# EAGLE design ESP32_GPS_Motion_Shield (EAGLE 7.7.0)
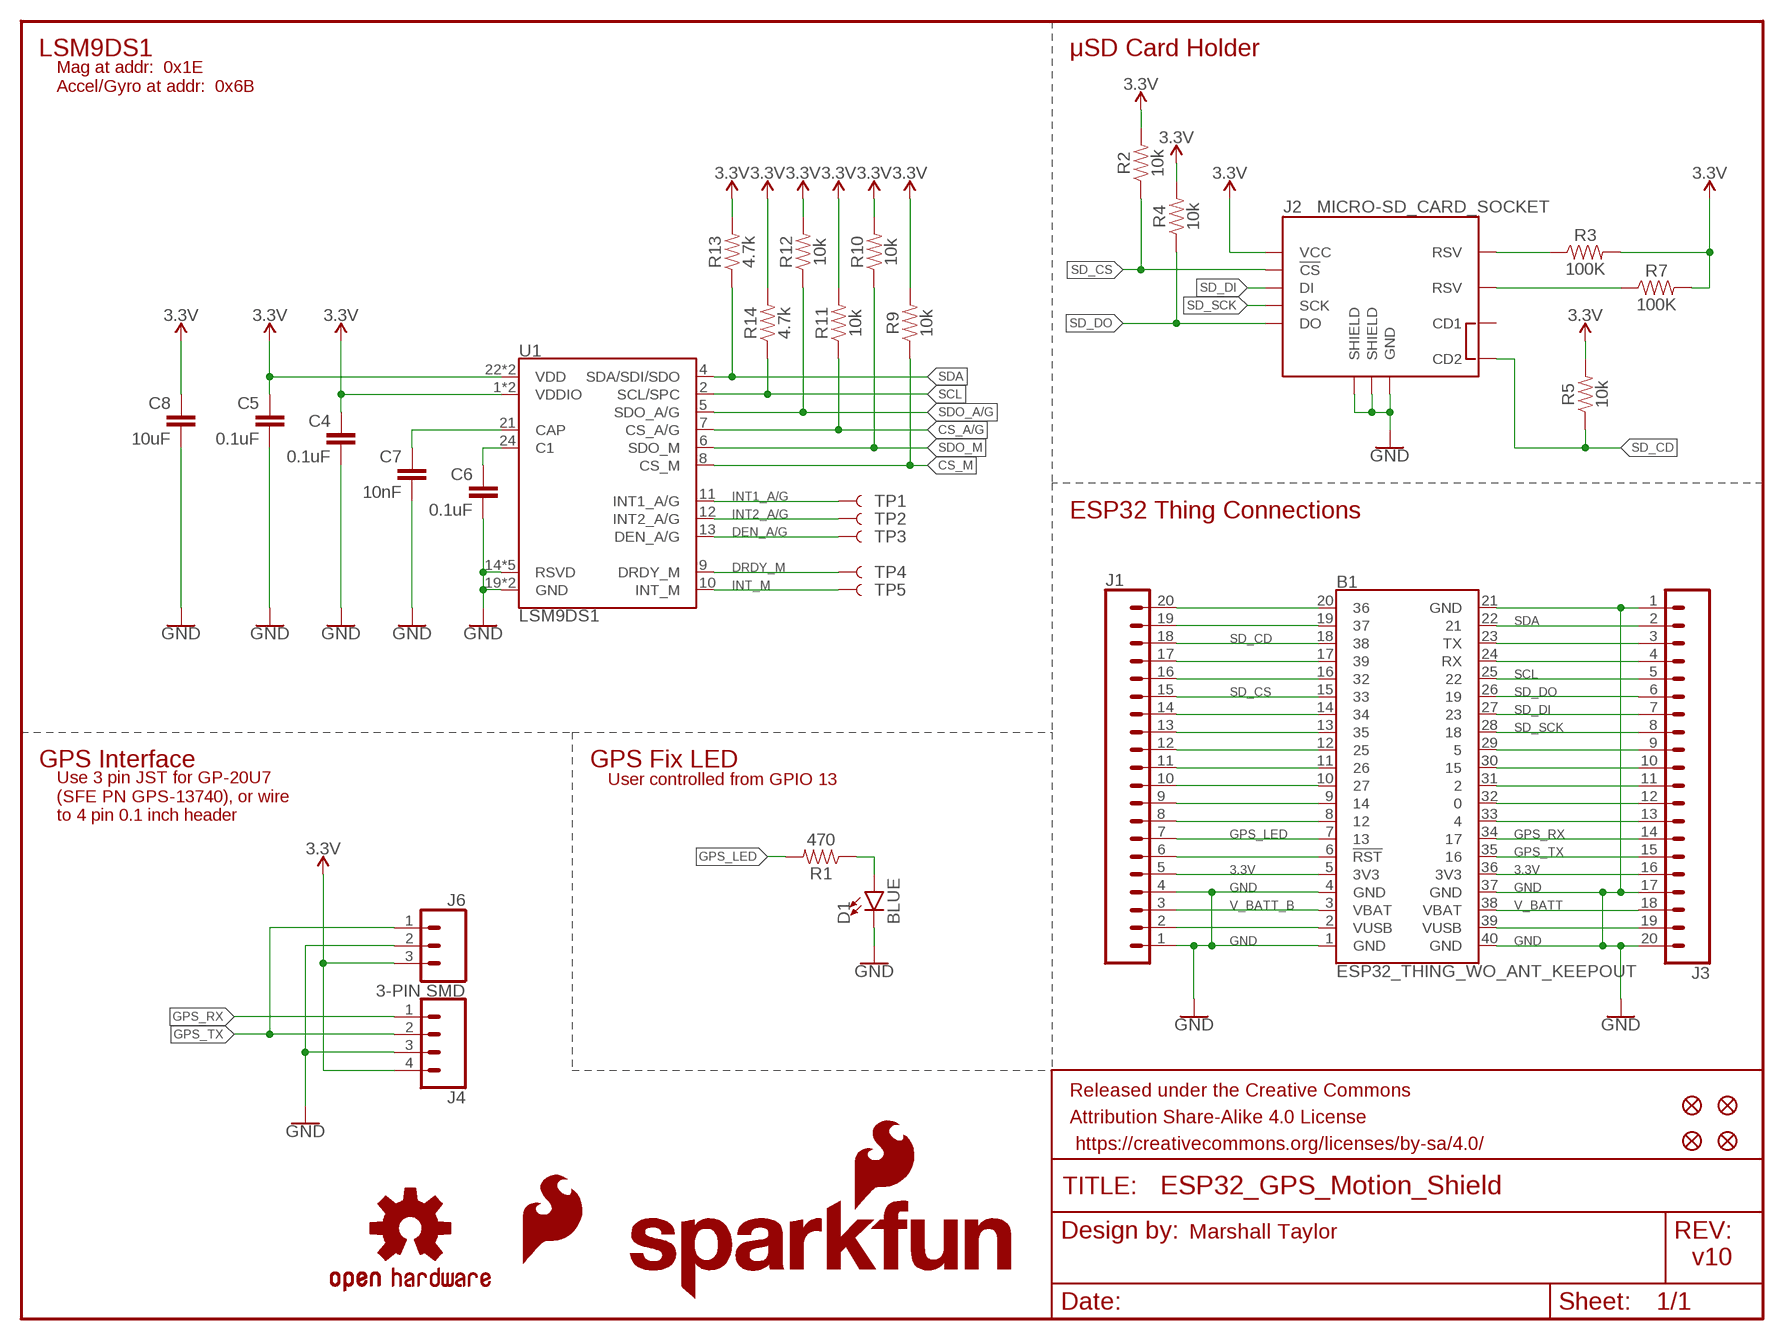
[diagram p0: schematic, sheet 1]

## Parts
B1  ESP32_THING_WO_ANT_KEEPOUT  [ESP32_THING_NO_ANT]
C4  0.1uF  0.1UF-0402-16V-10%  [0402]
C5  0.1uF  0.1UF-0402-16V-10%  [0402]
C6  0.1uF  0.1UF-0402-16V-10%  [0402]
C7  10nF  10NF-0603-50V-10%  [0603]
C8  10uF  10UF-0603-6.3V-20%  [0603]
D1  BLUE  LED-BLUE0603  [LED-0603]
FD1  FIDUCIALUFIDUCIAL  [FIDUCIAL-MICRO]
FD2  FIDUCIALUFIDUCIAL  [FIDUCIAL-MICRO]
FD3  FIDUCIALUFIDUCIAL  [FIDUCIAL-MICRO]
FD4  FIDUCIALUFIDUCIAL  [FIDUCIAL-MICRO]
FRAME1  FRAME-LETTER  [CREATIVE_COMMONS]
J1  CONN_20NOSILK  [1X20_NOSILK]
J2  MICRO-SD_CARD_SOCKET  [MICRO-SD-SOCKET]
J3  CONN_20NOSILK  [1X20_NOSILK]
J4  CONN_04  [1X04]
J6  3-PIN SMD  CONN_03JST-SMD  [JST-3-SMD]
LOGO1  OSHW-LOGOS  [OSHW-LOGO-S]
LOGO2  SFE_LOGO_NAME_FLAME.2_INCH  [SFE_LOGO_NAME_FLAME_.2]
LOGO3  SFE_LOGO_FLAME.1_INCH  [SFE_LOGO_FLAME_.1]
R1  470  470OHM-0603-1/10W-1%  [0603]
R2  10k  10KOHM-0603-1/10W-1%  [0603]
R3  100K  100KOHM-0402-1/16W-1%  [0402]
R4  10k  10KOHM-0603-1/10W-1%  [0603]
R5  10k  10KOHM-0603-1/10W-1%  [0603]
R7  100K  100KOHM-0402-1/16W-1%  [0402]
R9  10k  10KOHM-0603-1/10W-1%  [0603]
R10  10k  10KOHM-0603-1/10W-1%  [0603]
R11  10k  10KOHM-0603-1/10W-1%  [0603]
R12  10k  10KOHM-0603-1/10W-1%  [0603]
R13  4.7k  4.7KOHM-0603-1/10W-1%  [0603]
R14  4.7k  4.7KOHM-0603-1/10W-1%  [0603]
TP1  TEST-POINT3  [PAD.03X.03]
TP2  TEST-POINT3  [PAD.03X.03]
TP3  TEST-POINT3  [PAD.03X.03]
TP4  TEST-POINT3  [PAD.03X.03]
TP5  TEST-POINT3  [PAD.03X.03]
U1  LSM9DS1  [LGA-24-3.5X3]

## Nets
3.3V: B1.5(3V3) B1.36(3V3) C4.1 C5.1 C8.1 J1.5 J2.VCC J3.16 J4.4 J6.3 R2.2 R3.2 R4.2 R5.2 R7.2 R9.2 R10.2 R11.2 R12.2 R13.2 R14.2 U1.1(VDDIO) U1.3(VDDIO) U1.22(VDD) U1.23(VDD)
C1: C6.1 U1.24(C1)
CAP: C7.1 U1.21(CAP)
CS_A/G: R11.1 U1.7(CS_A/G)
CS_M: R9.1 U1.8(CS_M)
DEN_A/G: TP3.P$1 U1.13(DEN_A/G)
DRDY_M: TP4.P$1 U1.9(DRDY_M)
GND: B1.1(GND) B1.4(GND) B1.21(GND) B1.37(GND) B1.40(GND) C4.2 C5.2 C6.2 C7.2 C8.2 D1.C J1.1 J1.4 J2.GND J2.GND1(SHIELD) J2.GND3(SHIELD) J3.1 J3.17 J3.20 J4.3 J6.2 U1.14(RSVD) U1.15(RSVD) U1.16(RSVD) U1.17(RSVD) U1.18(RSVD) U1.19(GND) U1.20(GND)
GPS_LED: B1.7 J1.7 R1.2
GPS_RX: B1.34 J3.14 J4.1
GPS_TX: B1.35 J3.15 J4.2 J6.1
INT1_A/G: TP1.P$1 U1.11(INT1_A/G)
INT2_A/G: TP2.P$1 U1.12(INT2_A/G)
INT_M: TP5.P$1 U1.10(INT_M)
N$1: D1.A R1.1
N$2: B1.30 J3.10
N$3: B1.17 J1.17
N$4: B1.16 J1.16
N$5: B1.19 J1.19
N$6: B1.10 J1.10
N$7: B1.14 J1.14
N$9: J2.RSV1(RSV) R3.1
N$10: J2.RSV2(RSV) R7.1
N$15: B1.6(!RST!) J1.6
N$17: B1.8 J1.8
N$18: B1.9 J1.9
N$20: B1.11 J1.11
N$21: B1.12 J1.12
N$22: B1.13 J1.13
N$23: B1.20 J1.20
N$32: B1.23(TX) J3.3
N$33: B1.24(RX) J3.4
N$38: B1.29 J3.9
N$40: B1.31 J3.11
N$41: B1.32 J3.12
N$42: B1.33 J3.13
SCL: B1.25 J3.5 R14.1 U1.2(SCL/SPC)
SD_CD: B1.18 J1.18 J2.CD2 R5.1
SD_CS: B1.15 J1.15 J2.CS(!CS) R2.1
SD_DI: B1.27 J2.DI J3.7
SD_DO: B1.26 J2.DO J3.6 R4.1
SD_SCK: B1.28 J2.SCLK(SCK) J3.8
SDA: B1.22 J3.2 R13.1 U1.4(SDA/SDI/SDO)
SDO_A/G: R12.1 U1.5(SDO_A/G)
SDO_M: R10.1 U1.6(SDO_M)
V_BATT: B1.38(VBAT) J3.18
V_BATT_B: B1.3(VBAT) J1.3
VUSB: B1.39(VUSB) J3.19
VUSB_B: B1.2(VUSB) J1.2
Unconnected: J2.CD1

## Notes on the sheet
- LSM9DS1 | μSD Card Holder
- Mag at addr:  0x1E
  Accel/Gyro at addr:  0x6B
- ESP32 Thing Connections
- GPS Interface | GPS Fix LED
- User controlled from GPIO 13
- Use 3 pin JST for GP-20U7
  (SFE PN GPS-13740), or wire
  to 4 pin 0.1 inch header
- Marshall Taylor
- v10

## Library data of the parts
B1 = SparkFun-Boards:ESP32_THING: SparkFun ESP32 Thing Board Pins, silkscreen, and logos matching the layout of the SparkFun ESP32 Thing <https://www.sparkfun.com/products/13907> Dimensions: 2.32" x 1.00"
C4-C6 = SparkFun-Capacitors:0.1UF: 0.1µF ceramic capacitors A capacitor is a passive two-terminal electrical component used to store electrical energy temporarily in an electric field.; PROD_ID: CAP-12416
C7 = SparkFun-Capacitors:10NF: 0.01uF/10nF/10,000pF ceramic capacitors A capacitor is a passive two-terminal electrical component used to store electrical energy temporarily in an electric field. CAP-09321; PROD_ID: CAP-00867
C8 = SparkFun-Capacitors:10UF: 10.0µF ceramic capacitors A capacitor is a passive two-terminal electrical component used to store electrical energy temporarily in an electric field.; PROD_ID: CAP-11015
D1 = SparkFun-LED:LED-BLUE: Blue SMD LED Used in manufacturing of various products at SparkFun Packages: 0603 - SMD 0603 package [Product Link] <http://www.digikey.com/product-detail/en/SMLE12BC7TT86/511-1589-2-ND/1641808> 1206 - SMD1206 package [Product Link] <http://www.digikey.com/product-detail/en/lite-on-inc/LTST-C150TBKT/160-1643-1-ND/573584> SparkFun Products: ESP8266 Thing-Dev Board <https://www.sparkfun.com/products/13711> RedBoard <https://www.sparkfun.com/products/12757>; PROD_ID: DIO-08575
FD1-FD4 = SparkFun-Aesthetics:FIDUCIAL: Fiducial Alignment Points Point-of-reference for pick-and-place machines and other optical instruments.
FRAME1 = SparkFun-Aesthetics:FRAME-LETTER: Schematic Frame - Letter Standard 8.5x11 US Letter frame
J1 J3 = SparkFun-Connectors:CONN_20: Multi connection point. Often used as Generic Header-pin footprint for 0.1 inch spaced/style header connections On any of the 0.1 inch spaced packages, you can populate with these: Break Away Headers - Straight <https://www.sparkfun.com/products/116> (PRT-00116) Break Away Male Headers - Right Angle <https://www.sparkfun.com/products/553> (PRT-00553) Female Headers <https://www.sparkfun.com/products/115> (PRT-00115) Break Away Headers - Machine Pin <https://www.sparkfun.com/products/117> (PRT-00117) Break Away Female Headers - Swiss Machine Pin <https://www.sparkfun.com/products/743> (PRT-00743) For SCREWTERMINALS and SPRING TERMINALS visit here: Screw Terimnals on SparkFun.com <https://www.sparkfun.com/search/results?term=Screw+Terminals> (5mm/3.5mm/2.54mm spacing) This device is also useful as a general connection point to wire up your design to another part of your project. Our various solder wires solder well into these plated through hole pads. Hook-Up Wire - Assortment (Stranded, 22 AWG) <https://www.sparkfun.com/products/11375> (PRT-11375) Hook-Up Wire - Assortment (Solid Core, 22 AWG) <https://www.sparkfun.com/products/11367> (PRT-11367) View the entire wire category on our website here <https://www.sparkfun.com/categories/141> Special notes: Molex polarized connector foot print use with SKU : PRT-08231 with associated crimp pins and housings. 1MM SMD Version SKU: PRT-10208 NOTES ON THE VARIANTS LOCK and LOCK_LONGPADS... This footprint was designed to help hold the alignment of a through-hole component (i.e. 6-pin header) while soldering it into place. You may notice that each hole has been shifted either up or down by 0.005 of an inch from it's more standard position (which is a perfectly straight line). This slight alteration caused the pins (the squares in the middle) to touch the edges of the holes. Because they are alternating, it causes a "brace" to hold the component in place. 0.005 has proven to be the perfect amount of "off-center" position when using our standard breakaway headers. Although looks a little odd when you look at the bare footprint, once you have a header in there, the alteration is very hard to notice. Also,if you push a header all the way into place, it is covered up entirely on the bottom side. Note about LOCK SPECIAL package: This is just like the LOCK variant in that the holes are staggared by 5 mil, but except for the last two holes. They are not altered from the "standard" footprint layout. This is used for a special purpose on the layout of our Graphic LCD Backpack. Make sure you want to use this device before selecting it for you project!
J2 = SparkFun-Connectors:MICRO-SD_CARD_SOCKET: microSD Socket for Transflash Push-push type µSD socket. tDoc lines correctly indicate media card edge positions when inserting (unlocked, locked, depressed). NOTE: CD1 and CD2 are connected internally, and the default detect state of the socket is detect pin to ground. SparkFun Products: WAV Trigger <https://www.sparkfun.com/products/13660> CAN-Bus Shield <https://www.sparkfun.com/products/13262> SparkFun Level Shifing microSD Breakout <https://www.sparkfun.com/products/13743>; PROD_ID: CONN-07820; SF_ID: PRT-00127
J4 = SparkFun-Connectors:CONN_04: Multi connection point. Often used as Generic Header-pin footprint for 0.1 inch spaced/style header connections On any of the 0.1 inch spaced packages, you can populate with these: Break Away Headers - Straight <https://www.sparkfun.com/products/116> (PRT-00116) Break Away Male Headers - Right Angle <https://www.sparkfun.com/products/553> (PRT-00553) Female Headers <https://www.sparkfun.com/products/115> (PRT-00115) Break Away Headers - Machine Pin <https://www.sparkfun.com/products/117> (PRT-00117) Break Away Female Headers - Swiss Machine Pin <https://www.sparkfun.com/products/743> (PRT-00743) For SCREWTERMINALS and SPRING TERMINALS visit here: Screw Terimnals on SparkFun.com <https://www.sparkfun.com/search/results?term=Screw+Terminals> (5mm/3.5mm/2.54mm spacing) This device is also useful as a general connection point to wire up your design to another part of your project. Our various solder wires solder well into these plated through hole pads. Hook-Up Wire - Assortment (Stranded, 22 AWG) <https://www.sparkfun.com/products/11375> (PRT-11375) Hook-Up Wire - Assortment (Solid Core, 22 AWG) <https://www.sparkfun.com/products/11367> (PRT-11367) View the entire wire category on our website here <https://www.sparkfun.com/categories/141> Special notes: Molex polarized connector foot print use with SKU : PRT-08231 with associated crimp pins and housings. 1MM SMD Version SKU: PRT-10208; PROD_ID: CONN-09696
J6 = SparkFun-Connectors:CONN_03: Multi connection point. Often used as Generic Header-pin footprint for 0.1 inch spaced/style header connections On any of the 0.1 inch spaced packages, you can populate with these: Break Away Headers - Straight <https://www.sparkfun.com/products/116> (PRT-00116) Break Away Male Headers - Right Angle <https://www.sparkfun.com/products/553> (PRT-00553) Female Headers <https://www.sparkfun.com/products/115> (PRT-00115) Break Away Headers - Machine Pin <https://www.sparkfun.com/products/117> (PRT-00117) Break Away Female Headers - Swiss Machine Pin <https://www.sparkfun.com/products/743> (PRT-00743) Stackable Header - 3 Pin (Female, 0.1") <https://www.sparkfun.com/products/13875> (PRT-13875) For SCREWTERMINALS and SPRING TERMINALS visit here: Screw Terimnals on SparkFun.com <https://www.sparkfun.com/search/results?term=Screw+Terminals> (5mm/3.5mm/2.54mm spacing) This device is also useful as a general connection point to wire up your design to another part of your project. Our various solder wires solder well into these plated through hole pads. Hook-Up Wire - Assortment (Stranded, 22 AWG) <https://www.sparkfun.com/products/11375> (PRT-11375) Hook-Up Wire - Assortment (Solid Core, 22 AWG) <https://www.sparkfun.com/products/11367> (PRT-11367) View the entire wire category on our website here <https://www.sparkfun.com/categories/141> Special notes: Molex polarized connector foot print use with SKU : PRT-08232 with associated crimp pins and housings.; PROD_ID: CONN-12591
LOGO1 = SparkFun-Aesthetics:OSHW-LOGO: Open-Source Hardware (OSHW) Logo This logo indicates the piece of hardware it is found on incorporates a OSHW license and/or adheres to the definition of open source hardware found here: http://freedomdefined.org/OSHW
LOGO2 = SparkFun-Aesthetics:SFE_LOGO_NAME_FLAME: SparkFun Font Logo w/ Flame This is the SparkFun full logo. The logo on the schematic will always be the same size; the package variant is the height of the flame part of the logo. Default layer for the logo on the board is tSilk.
LOGO3 = SparkFun-Aesthetics:SFE_LOGO_FLAME: SparkFun Flame Logo This is the SparkFun flame logo. The logo on the schematic will always be the same size; the package variant is the height of the flame. Default layer for the logo on the board is tSilk.
R1 = SparkFun-Resistors:470OHM: 470Ω resistor A resistor is a passive two-terminal electrical component that implements electrical resistance as a circuit element. Resistors act to reduce current flow, and, at the same time, act to lower voltage levels within circuits. - Wikipedia; PROD_ID: RES-07869
R2 R4 R5 R9-R12 = SparkFun-Resistors:10KOHM: 10kΩ resistor A resistor is a passive two-terminal electrical component that implements electrical resistance as a circuit element. Resistors act to reduce current flow, and, at the same time, act to lower voltage levels within circuits. - Wikipedia; PROD_ID: RES-00824
R3 R7 = SparkFun-Resistors:100KOHM: 100kΩ resistor A resistor is a passive two-terminal electrical component that implements electrical resistance as a circuit element. Resistors act to reduce current flow, and, at the same time, act to lower voltage levels within circuits. - Wikipedia; PROD_ID: RES-13495
R13 R14 = SparkFun-Resistors:4.7KOHM: 4.7kΩ resistor A resistor is a passive two-terminal electrical component that implements electrical resistance as a circuit element. Resistors act to reduce current flow, and, at the same time, act to lower voltage levels within circuits. - Wikipedia; PROD_ID: RES-07857
TP1-TP5 = SparkFun-Connectors:TEST-POINT: SparkFun Test Points Bare copper test points for troubleshooting or In-Circuit-Testing. These are used by our Production team for verifying production board runs using pogo-pins on test beds. SparkFun Products: SparkFun LSM9DS1 Breakout <https://www.sparkfun.com/products/13284> SparkFun PSOC <https://www.sparkfun.com/products/13714> SparkFun Load Cell Amplifier <https://www.sparkfun.com/products/13879>
U1 = SparkFun-Sensors:LSM9DS1: ST Microelectronics LSM9DS1 9DOF IMU - Accelerometer, Gyroscope & Magnetometer The LSM9DS1 is a versatile, motion-sensing system-in-a-chip. It houses a 3-axis accelerometer, 3-axis gyroscope, and 3-axis magnetometer – nine degrees of freedom (9DOF) in a single IC! The LSM9DS1 is equipped with a digital interface, but even that is flexible: it supports both I2C and SPI, so you’ll be hard-pressed to find a microcontroller it doesn’t work with. Datasheet <https://cdn.sparkfun.com/assets/learn_tutorials/3/7/3/LSM9DS1_Datasheet.pdf> SparkFun Products SparkFun 9 Degrees of Freedom IMU Breakout - LSM9DS1 <https://www.sparkfun.com/products/13284> (SEN-13284) SparkFun Photon IMU Shield <https://www.sparkfun.com/products/13629> (DEV-13629); PROD_ID: IC-12536

## Board
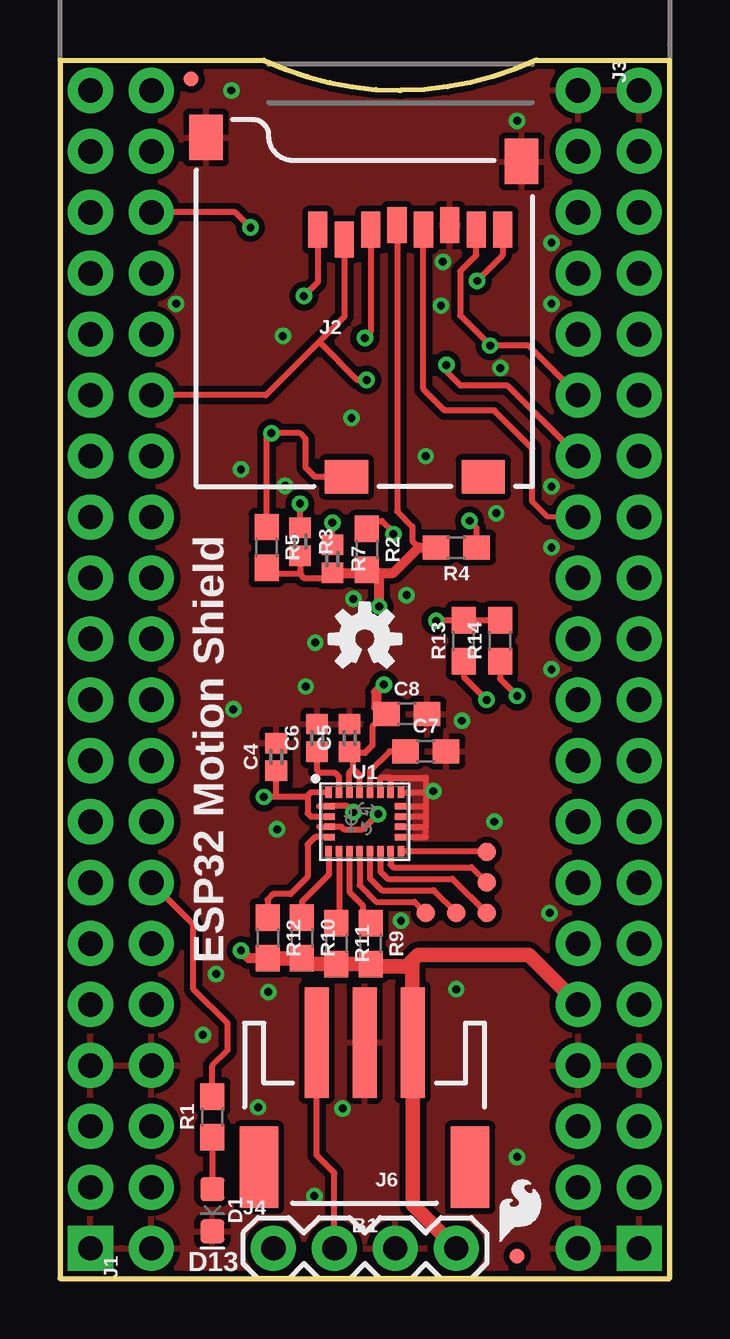
[diagram p1: board, top side]
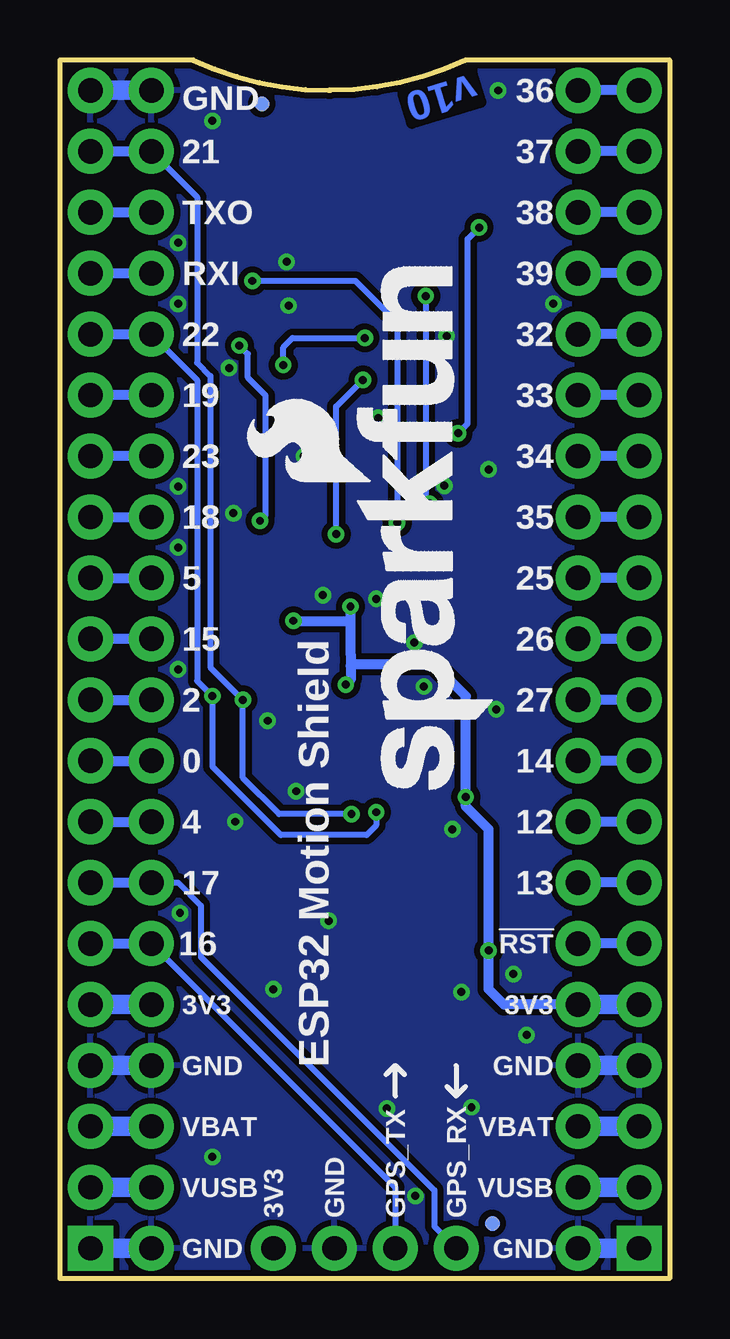
[diagram p2: board, bottom side, seen from below]

Size 25.4 x 50.8 mm. Coordinates in mm from the lower left corner, seen from the top.
Outline: 0,0 25.4,0 25.4,50.8 19.84,50.8 arc-25 14.21,49.53 14.13,49.53 arc-25 8.49,50.8 0,50.8 0,0
Copper layers (1*16): Top 0.035mm / dielectric 1.5mm / Bottom 0.035mm
Design rules "SparkFun-2-layer-TIGHT *": minimum track width 7mil, minimum drill 13mil, track to track 7mil, track to pad 7mil, pad to pad 7mil, via to via 7mil, smd to smd 7mil, copper to edge 7mil, drill to drill 7mil, minimum pad ring 7mil, minimum via ring 7mil, stop-mask expansion 4mil, vias tented up to drill 25mil, thermal gap 10mil

### Footprints (pad centres in the part's own frame; a part is rotated, then mirrored left to right if it is on the bottom)
ESP32_THING_NO_ANT = drill 1.016 pad 1.88 square: 1 1.27,1.27; 40 24.13,1.27 | drill 1.016 pad 1.88: 2 1.27,3.81; 3 1.27,6.35; 4 1.27,8.89; 5 1.27,11.43; 6 1.27,13.97; 7 1.27,16.51; 8 1.27,19.05; 9 1.27,21.59; 10 1.27,24.13; 11 1.27,26.67; 12 1.27,29.21; 13 1.27,31.75; 14 1.27,34.29; 15 1.27,36.83; 16 1.27,39.37; 17 1.27,41.91; 18 1.27,44.45; 19 1.27,46.99; 20 1.27,49.53; 21 24.13,49.53; 22 24.13,46.99; 23 24.13,44.45; 24 24.13,41.91; 25 24.13,39.37; 26 24.13,36.83; 27 24.13,34.29; 28 24.13,31.75; 29 24.13,29.21; 30 24.13,26.67; 31 24.13,24.13; 32 24.13,21.59; 33 24.13,19.05; 34 24.13,16.51; 35 24.13,13.97; 36 24.13,11.43; 37 24.13,8.89; 38 24.13,6.35; 39 24.13,3.81
0402 = smd 0.85 x 0.9: 1 -0.58,0; 2 0.58,0
0603 = smd 1.1 x 1: 1 -0.85,0; 2 0.85,0
LED-0603 = smd 1 x 1: A -0.877,0; C 0.877,0
FIDUCIAL-MICRO = smd 0.635 x 0.635: 1 0,0
1X20_NOSILK = drill 1.016 pad 1.88: 1 0,0; 2 2.54,0; 3 5.08,0; 4 7.62,0; 5 10.16,0; 6 12.7,0; 7 15.24,0; 8 17.78,0; 9 20.32,0; 10 22.86,0; 11 25.4,0; 12 27.94,0; 13 30.48,0; 14 33.02,0; 15 35.56,0; 16 38.1,0; 17 40.64,0; 18 43.18,0; 19 45.72,0; 20 48.26,0
MICRO-SD-SOCKET = smd 1.8 x 1.4: CD1 -2.05,0.4; CD2 -7.75,0.4 | smd 0.8 x 1.5: CS -7.84,10.3; DI -6.74,10.7; DO -2.34,10.7; GND -3.44,10.9; RSV1 -8.94,10.7; RSV2 -1.24,10.7; SCLK -4.54,10.7; VCC -5.64,10.9 | smd 1.4 x 1.9: GND1 -13.6,14.55; GND3 -0.45,13.55
1X04 = drill 1.016 pad 1.88: 1 0,0; 2 2.54,0; 3 5.08,0; 4 7.62,0
JST-3-SMD = smd 1 x 4.6: 1 2.01,-4.77; 2 0.01,-4.77; 3 -1.99,-4.77 | smd 1.6 x 3.4: NC1 -4.39,0.43; NC2 4.41,0.43
PAD.03X.03 = smd 0.762 x 0.762: P$1 0,0
LGA-24-3.5X3 = smd 0.27 x 0.45: 1 -1.505,1.225; 6 -1.505,-1.225; 7 -1.075,-1.225; 8 -0.645,-1.225; 9 -0.215,-1.225; 10 0.215,-1.225; 11 0.645,-1.225; 12 1.075,-1.225; 13 1.505,-1.225; 18 1.505,1.225; 19 1.075,1.225; 20 0.645,1.225; 21 0.215,1.225; 22 -0.215,1.225; 23 -0.645,1.225; 24 -1.075,1.225 | smd 0.45 x 0.27: 2 -1.475,0.645; 3 -1.475,0.215; 4 -1.475,-0.215; 5 -1.475,-0.645; 14 1.475,-0.645; 15 1.475,-0.215; 16 1.475,0.215; 17 1.475,0.645

### Placement (x,y rotation side)
B1  0,0 0 top
C4  9.01,21.75 90 top
C5  12.06,22.54 90 top
C6  10.72,22.54 90 top
C7  15.24,21.99 0 top
C8  14.45,23.53 0 top
D1  6.35,2.86 270 top
FD1  19.05,0.95 0 top
FD2  5.46,50.01 0 top
FD3  16.99,48.97 0 bottom
FD4  7.38,2.3 0 bottom
FRAME1  -23.7,-19.91 0 top  (outside the outline)
J1  3.81,1.27 90 top
J2  19.68,33.02 0 top
J3  21.59,49.53 270 top
J4  8.89,1.27 0 top
J6  12.7,5.08 180 top
LOGO1  12.7,26.67 0 top
LOGO2  7.3,19.68 90 bottom
LOGO3  18.02,1.21 0 top
R1  6.35,6.75 90 top
R2  12.78,30.4 270 top
R3  10,30.72 270 top
R4  16.51,30.48 180 top
R5  8.6,30.48 270 top
R7  11.35,30 270 top
R9  12.94,13.97 270 top
R10  10.08,14.21 270 top
R11  11.51,13.97 270 top
R12  8.65,14.21 270 top
R13  16.83,26.59 90 top
R14  18.34,26.59 90 top
TP1  17.78,15.24 90 top
TP2  17.78,16.51 90 top
TP3  17.78,17.78 90 top
TP4  15.24,15.24 90 top
TP5  16.51,15.24 90 top
U1  12.7,19.05 0 top

### Tracks (layer width: path | path; a pad name or v marks a point on that pad's centre or on a via)
3.3V  (via drill 0.33)
  Top 0.254: J2.VCC 14.04,31.99 14.68,31.35 14.68,30.74 14.95,30.48 | R10.2 10.08,13.26 | R3.2 10,29.37 | 10,29.37 10.16,29.21 11.14,29.21 | R14.2 R13.2 15.69,27.44 v15.68,27.42 | R2.2 12.89,29.44 13.88,29.44 13.89,29.42 | U1.1 10.46,20.27 10.32,20.14 10.32,20.08 | 10.32,20.08 10.32,19.39 10.45,19.27 U1.3 | 10.32,20.08 9.01,20.08 | 9.01,20.08 C4.1 | 9.01,20.08 v8.49,20.08 | 10,29.37 8.87,29.37 R5.2 | U1.23 12.05,21.1 12.22,21.27 | U1.22 12.48,21.01 12.22,21.27 | 12.22,21.27 12.22,21.8 C5.1 12.12,21.91 12.7,21.91 13.02,22.23 13.02,23.02 13.53,23.54 C8.1
  Top 0.406: R12.2 7.86,13.36 v7.54,13.68 | 11.14,29.21 R7.2 13.29,29.42 | 13.29,29.42 13.89,29.42 14.95,30.48 R4.2 | v13.29,28.02 13.29,29.42 | v13.49,24.77 13.18,24.45 13.18,23.81 13.45,23.54 C8.1
  Top 0.61: R12.2 R10.2 10.32,13.12 R11.2 R9.2 13.04,13.02 14.45,13.02 14.68,13.26 | J3.16 19.53,13.49 14.92,13.49 14.68,13.26 | 14.68,13.26 J6.3 14.69,3.09 J4.4
  Bottom 0.254: 13.29,26.04 13.29,26.51
  Bottom 0.406: 13.29,27.42 13.29,26.04 13.29,25.56 | 13.29,27.42 v13.29,28.02 | v15.68,27.42 13.29,27.42 | J1.5 6.91,11.43 7.54,12.06 v7.54,13.68 7.54,18.73 8.49,19.68 v8.49,20.08 8.49,24.29 9.8,25.6 13.26,25.6 13.29,25.56 | 13.29,25.56 13.29,24.96 v13.49,24.77
  Bottom 0.813: B1.36 J3.16 | B1.5 J1.5
C1
  Top 0.254: U1.24 11.62,20.92 11.47,21.07 10.84,21.07 10.72,21.19 C6.1
CAP
  Top 0.254: C7.1 13.73,21.99 12.91,21.17 U1.21
CS_A/G
  Top 0.254: U1.7 11.62,14.94 R11.1
CS_M
  Top 0.254: U1.8 12.05,16.12 12.62,15.56 12.62,15.14 R9.1
DEN_A/G
  Top 0.254: U1.13 17.73,17.82 TP3.P$1
DRDY_M
  Top 0.254: U1.9 12.48,16.41 13.18,15.72 14.76,15.72 TP4.P$1
GND  (via drill 0.33)
  Top 0.254: U1.14 15.24,18.41 15.24,18.84 | U1.15 15.24,18.84 | U1.16 15.24,19.27 | 15.24,19.27 15.24,18.84 | U1.17 15.24,19.7 | 15.24,19.7 15.24,19.27 | U1.18 15.24,20.27 | 15.24,20.27 15.24,19.7 | U1.19 13.78,20.88 | 13.78,20.88 13.35,20.88 U1.20 | 13.78,20.88 15.24,20.88 15.24,20.27
  Bottom 0.813: J3.1 B1.21 | B1.4 J1.4 | B1.1 J1.1 | B1.40 J3.20 | B1.37 J3.17
  other vias: 7.54,33.73 20.48,33.02 15.88,40.56 4.84,40.64 8.26,7.14 11.78,7.1 5.95,10.16 20.4,15.24 18.1,19.05 16.75,23.26 20.48,25.4 20.48,30.48 9.05,18.73 10.24,24.69 15.24,34.29 12.14,35.88 9.38,33.05 9.29,39.29 18.18,31.91 7.14,49.53 19.05,48.26 15.95,42.39 20.48,40.64 20.48,43.18 15.56,20.32 14.21,14.92 8.68,11.95 12.22,28.34 7.22,23.73 10.64,26.51 6.51,12.7 14.45,28.5 10.6,3.45 18.35,37.96 16.51,12.06 19.05,5.08
  pour Top (isolate 0.254): 0,50.8 0,0 25.4,0 25.4,50.8
  pour Bottom (isolate 0.254): 25.4,50.8 25.4,0 0,0 0,50.8
GPS_LED
  Top 0.254: R1.2 6.35,8.89 6.99,9.53 6.99,10.64 5.56,12.06 5.56,14.76 J1.7
  Bottom 0.406: B1.7 J1.7
GPS_RX
  Bottom 0.254: J3.14 20.48,16.51 19.53,15.56 19.53,13.41 9.8,3.69 9.8,2.18 J4.1
  Bottom 0.406: B1.34 J3.14
GPS_TX
  Top 0.254: J4.2 11.43,4.41 10.69,5.14 J6.1
  Bottom 0.254: J3.15 11.43,3.81 J4.2
  Bottom 0.406: B1.35 J3.15
INT1_A/G
  Top 0.254: U1.11 13.35,16.98 13.65,16.67 16.35,16.67 TP1.P$1
INT2_A/G
  Top 0.254: U1.12 13.78,17.26 13.89,17.14 17.14,17.14 TP2.P$1
INT_M
  Top 0.254: U1.10 12.91,16.69 13.41,16.19 15.56,16.19 TP5.P$1
N$1
  Top 0.254: R1.1 D1.A
N$2
  Bottom 0.406: J3.10 B1.30
N$3
  Bottom 0.406: B1.17 J1.17
N$4
  Bottom 0.406: B1.16 J1.16
N$5
  Bottom 0.406: B1.19 J1.19
N$6
  Bottom 0.406: B1.10 J1.10
N$7
  Bottom 0.406: B1.14 J1.14
N$9  (via drill 0.33)
  Top 0.254: J2.RSV1 10.74,41.54 v10.16,40.96 | R3.1 v10,32.31
  Bottom 0.254: v10.16,40.96 10.16,32.46 v10,32.31
N$10  (via drill 0.33)
  Top 0.254: J2.RSV2 18.45,42.65 v17.38,41.59 | R7.1 v11.35,31.51
  Bottom 0.254: v17.38,41.59 13.1,41.59 11.35,39.85 v11.35,31.51
N$15
  Bottom 0.406: B1.6 J1.6
N$17
  Bottom 0.406: B1.8 J1.8
N$18
  Bottom 0.406: B1.9 J1.9
N$20
  Bottom 0.406: B1.11 J1.11
N$21
  Bottom 0.406: B1.12 J1.12
N$22
  Bottom 0.406: B1.13 J1.13
N$23
  Bottom 0.406: B1.20 J1.20
N$32
  Bottom 0.406: B1.23 J3.3
N$33
  Bottom 0.406: B1.24 J3.4
N$38
  Bottom 0.406: B1.29 J3.9
N$40
  Bottom 0.406: B1.31 J3.11
N$41
  Bottom 0.406: B1.32 J3.12
N$42
  Bottom 0.406: B1.33 J3.13
SCL  (via drill 0.33)
  Top 0.254: R14.1 18.34,25 v19.05,24.29 | v12.22,19.45 11.97,19.7 U1.2 | 10.78,19.7 U1.2 | U1.2
  Bottom 0.254: J3.5 19.68,37.47 19.68,24.92 v19.05,24.29 19.05,21.35 16.19,18.49 12.62,18.49 12.22,18.89 v12.22,19.45
  Bottom 0.406: B1.25 J3.5
SD_CD  (via drill 0.33)
  Top 0.254: J2.CD2 10.63,33.42 10.24,33.81 10.24,35 10,35.24 v8.81,35.24 8.6,35.04 R5.1 | v7.94,43.81 7.3,44.45 J1.18
  Bottom 0.254: v8.81,35.24 8.41,35.64 8.41,43.34 v7.94,43.81
  Bottom 0.406: B1.18 J1.18
SD_CS  (via drill 0.33)
  Top 0.254: J2.CS 11.85,40.1 10.79,39.05 | 10.79,39.05 8.57,36.83 J1.15 | 10.79,39.05 12.38,37.47 v12.78,37.47 | R2.1 13.12,31.59 13.41,31.59 13.89,31.11 v13.89,31.04
  Bottom 0.254: v13.89,31.04 13.89,36.35 v12.78,37.47
  Bottom 0.406: B1.15 J1.15
SD_DI  (via drill 0.33)
  Top 0.254: J2.DI 12.95,39.46 v12.7,39.21 | J3.7 18.65,37.23 16.7,37.23 16.1,37.83 v16.1,38.08
  Bottom 0.254: v16.1,38.08 16.1,38.83 15.71,39.21 v12.7,39.21
  Bottom 0.406: J3.7 B1.27
SD_DO  (via drill 0.33)
  Top 0.254: J2.DO 17.34,42.67 16.67,41.99 16.67,40.16 17.92,38.91 v17.92,38.89 19.53,38.89 J3.6 | R4.1 17.36,31.3 v17.07,31.59
  Bottom 0.254: v17.07,31.59 16.83,31.83 16.83,36.81 17.57,37.56 17.57,38.54 v17.92,38.89
  Bottom 0.406: J3.6 B1.26
SD_SCK
  Top 0.203: J3.8 20.32,31.75 19.68,32.38
  Top 0.254: 19.68,32.38 19.68,34.61 18.1,36.2 16.03,36.2 15.14,37.08 J2.SCLK
  Bottom 0.406: B1.28 J3.8
SDA  (via drill 0.33)
  Top 0.254: v13.26,19.37 12.62,18.73 11.83,18.73 11.72,18.84 U1.4 10.78,18.83 10.78,18.84 | R13.1 16.83,25.08 v17.78,24.13
  Bottom 0.254: J3.2 19.68,45.09 19.68,38.18 19.13,37.62 19.13,25.48 v17.78,24.13 17.78,20.88 16.27,19.37 v13.26,19.37
  Bottom 0.406: B1.22 J3.2
SDO_A/G
  Top 0.254: U1.5 10.63,18.41 10.32,18.1 10.32,16.75 9.6,16.03 8.89,16.03 8.65,15.8 R12.1
SDO_M
  Top 0.254: U1.6 11.2,16.83 10.08,15.72 R10.1
V_BATT
  Bottom 0.813: B1.38 J3.18
V_BATT_B
  Bottom 0.813: B1.3 J1.3
VUSB
  Bottom 0.813: B1.39 J3.19
VUSB_B
  Bottom 0.813: B1.2 J1.2

### Text on the board
Bottom: v10
tPlace: ESP32 Motion Shield | D13
bPlace: 36 | GND | 37 | 21 | 38 | TXO | 39 | RXI | 32 | 22 | 33 | 19 | 34 | 23 | 35 | 18 | 25 | 5 | 26 | 15 | 27 | 2 | 14 | 0 | 12 | 4 | ESP32 Motion Shield | 13 | 17 | !RST! | 16 | 3V3 | 3V3 | GND | GND | VBAT | VBAT | VUSB | VUSB | GPS_RX | GPS_TX | GND | 3V3 | GND | GND
Measures: Units are in Inches
tDocu: Marshall Taylor